# EAGLE schematic pocket_avr_programmer_to_attiny_x5 (EAGLE 9.1.3)
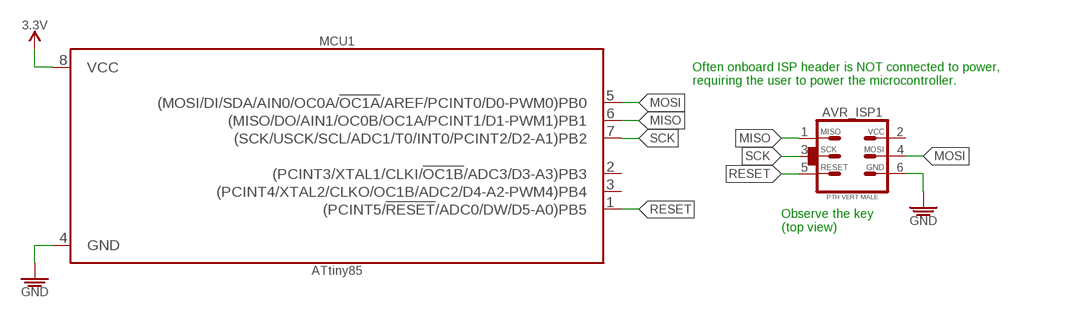
[diagram p0: schematic, sheet 1]

## Parts
AVR_ISP1  PTH VERT MALE  AVR_SPI_PRG_6_PTH_VERT_MALE_2.54MM  [HDRV6W64P254_2X3_762X483X838B_AVR-ISP]
MCU1  ATtiny85  ATTINY-X5_DIP-8_ATTINY-85  [DIP787W45P254L958H533Q8B_DIP-8_ATTINY-X5]

## Nets
3.3V: MCU1.8(VCC)
GND: AVR_ISP1.GND MCU1.4(GND)
MISO: AVR_ISP1.MISO MCU1.6((MISO/DO/AIN1/OC0B/OC1A/PCINT1/D1-PWM1)PB1)
MOSI: AVR_ISP1.MOSI MCU1.5((MOSI/DI/SDA/AIN0/OC0A/!OC1A!/AREF/PCINT0/D0-PWM0)PB0)
RESET: AVR_ISP1.RESET MCU1.1((PCINT5/!RESET!/ADC0/DW/D5-A0)PB5)
SCK: AVR_ISP1.SCK MCU1.7((SCK/USCK/SCL/ADC1/T0/INT0/PCINT2/D2-A1)PB2)
Unconnected: AVR_ISP1.VCC MCU1.2((PCINT3/XTAL1/CLKI/!OC1B!/ADC3/D3-A3)PB3) MCU1.3((PCINT4/XTAL2/CLKO/OC1B/ADC2/D4-A2-PWM4)PB4)

## Notes on the sheet
- Often onboard ISP header is NOT connected to power,
  requiring the user to power the microcontroller.
- Observe the key
  (top view)

## Library data of the parts
AVR_ISP1 = PiB_connectors:AVR_SPI_PRG_6: AVR ISP 6 Pin This is the reduced ISP connector for AVR programming. Common on Arduino. This footprint will take up less PCB space and can be used with a 10-pin to 6-pin adapter such as SKU: BOB-08508; DATASHEET: https://cdn.amphenol-icc.com/media/wysiwyg/files/drawing/67996.pdf; DIST: Digikey; DISTLINK: https://www.digikey.com/products/en?keywords=609-3234-ND; DISTPN: 609-3234-ND; MFR: Amphenol FCI; MPN: 67997-206HLF
MCU1 = PiB_ic_microcontrollers:ATTINY-X5; DATASHEET: http://www.microchip.com/mymicrochip/filehandler.aspx?ddocname=en589893; DIST: Digikey; DISTLINK: https://www.digikey.com/products/en?keywords=ATTINY85-20PU-ND; DISTPN: ATTINY85-20PU-ND; MFR: Microchip Technology; MPN: ATTINY85-20PU; SPICEPREFIX: X